# Altium schematic sheet Relay.SchDoc
size A4
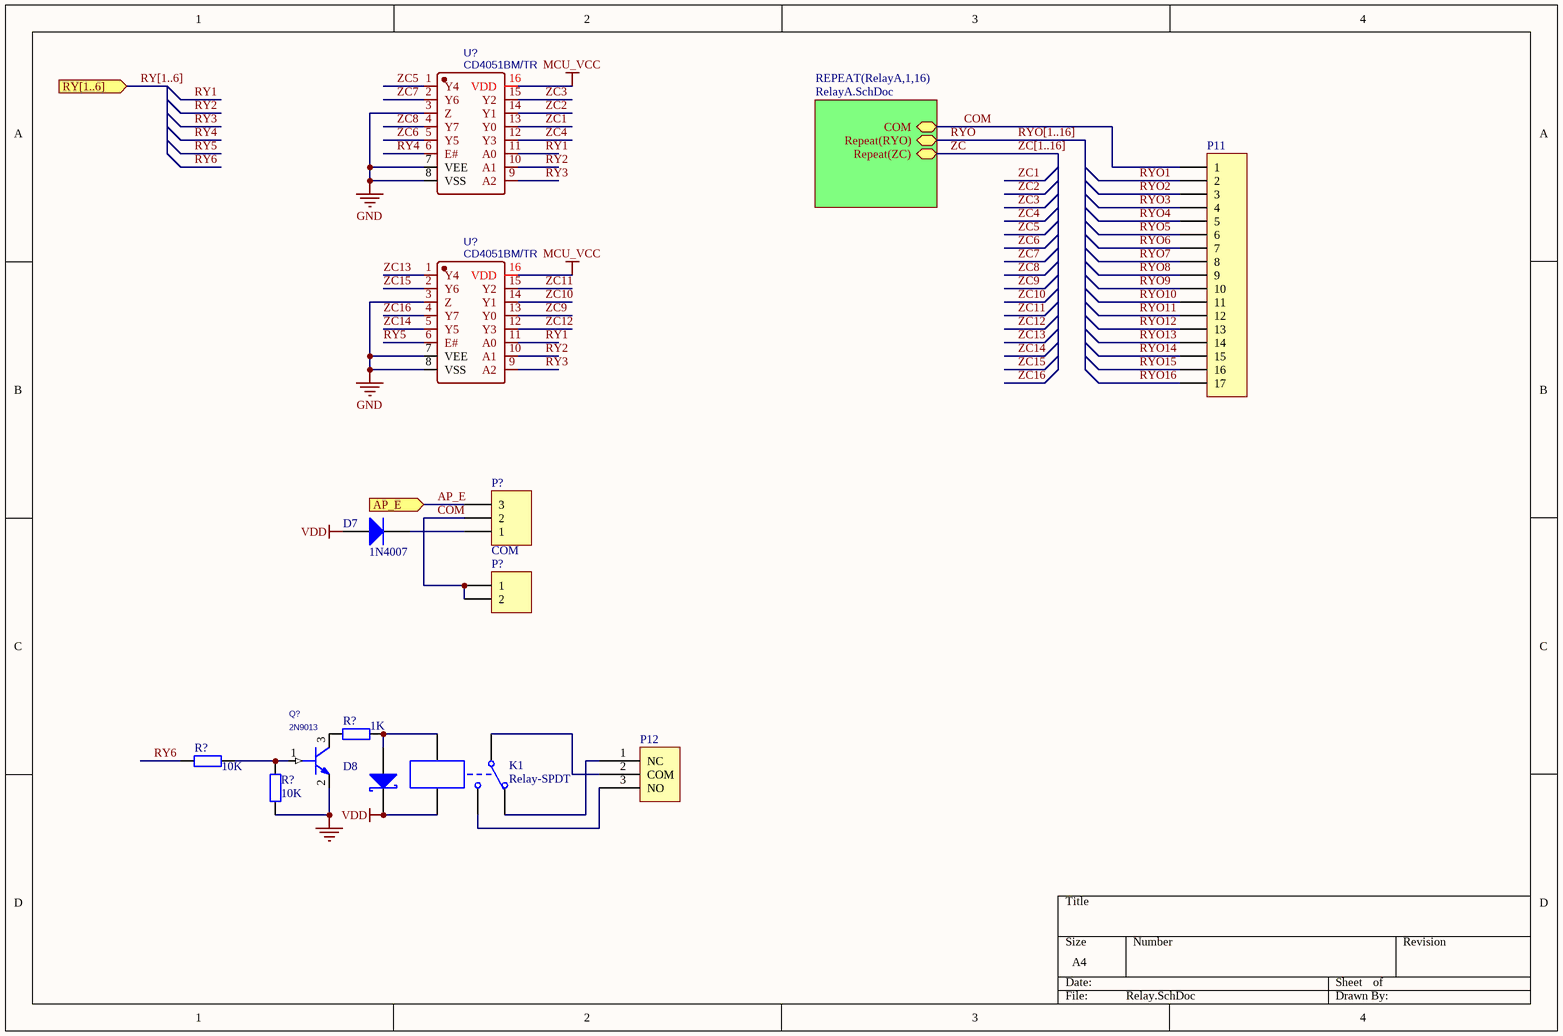
[diagram p0: Relay.SchDoc]

## Parts
(Parts that share a designator on the sheet are numbered #1, #2 ... from top to bottom, then left to right.)
D7  1N4007  [SO-0.4A]
D8  (no value)  [SO-0.4A]
K1  Relay-SPDT  [RELAY-TH_ZC-32F-012-ZS3-555]
P11  (no value)  [HDR1X17]
P12  (no value)  [HDR1X3]
P?#1  COM  [HDR1X3]
P?#2  Header 2  [SIP2]  (value not drawn)
Q?  2N9013  [SOT-23]
R?#1  value 1K  [R0603]
R?#2  value 10K  [R0603]
R?#3  value 10K  [R0603]
U?#1  CD4051BM/TR  [SOP-16_L9.9-W3.9-P1.27-LS6.1-BL]
U?#2  CD4051BM/TR  [SOP-16_L9.9-W3.9-P1.27-LS6.1-BL]

## Sub-sheets
REPEAT(RelayA,1,16) = RelayA.SchDoc: COM, Repeat(ZC) (bidir), Repeat(RYO) (bidir)

## Ports
AP_E (in), RY[1..6] (in)

## Nets
GND: Q?.2(E) R?#3.1 U?#1.3(Z) U?#1.7(VEE) U?#1.8(VSS) U?#2.3(Z) U?#2.7(VEE) U?#2.8(VSS)
MCU_VCC: U?#1.16(VDD) U?#2.16(VDD)
VDD: D7.A D8.K K1.5
AP_E: P?#1.3 ; port AP_E
COM: P11.1 P?#1.2 P?#2.1 P?#2.2 ; sheet REPEAT(RelayA,1,16)/COM
RY1: U?#1.11(A0) U?#2.11(A0)
RY2: U?#1.10(A1) U?#2.10(A1)
RY3: U?#1.9(A2) U?#2.9(A2)
RY4: U?#1.6(E#)
RY5: U?#2.6(E#)
RY6: R?#2.1
RYO: sheet REPEAT(RelayA,1,16)/Repeat(RYO)
RYO1: P11.2
RYO2: P11.3
RYO3: P11.4
RYO4: P11.5
RYO5: P11.6
RYO6: P11.7
RYO7: P11.8
RYO8: P11.9
RYO9: P11.10
RYO10: P11.11
RYO11: P11.12
RYO12: P11.13
RYO13: P11.14
RYO14: P11.15
RYO15: P11.16
RYO16: P11.17
ZC: sheet REPEAT(RelayA,1,16)/Repeat(ZC)
ZC1: U?#1.13(Y0)
ZC2: U?#1.14(Y1)
ZC3: U?#1.15(Y2)
ZC4: U?#1.12(Y3)
ZC5: U?#1.1(Y4)
ZC6: U?#1.5(Y5)
ZC7: U?#1.2(Y6)
ZC8: U?#1.4(Y7)
ZC9: U?#2.13(Y0)
ZC10: U?#2.14(Y1)
ZC11: U?#2.15(Y2)
ZC12: U?#2.12(Y3)
ZC13: U?#2.1(Y4)
ZC14: U?#2.5(Y5)
ZC15: U?#2.2(Y6)
ZC16: U?#2.4(Y7)
NetD7_K: D7.K P?#1.1
NetD8_A: D8.A K1.4 R?#1.2
NetK1_1: K1.1 P12.2(COM)
NetK1_2: K1.2 P12.1(NC)
NetK1_3: K1.3 P12.3(NO)
NetQ?_1: Q?.1(B) R?#2.2 R?#3.2
NetQ?_3: Q?.3(C) R?#1.1

## Buses and harness runs
bus RY[1..6] = port RY[1..6]
bus RYO[1..16]
bus ZC[1..16]

## Library data of the parts
D7 = Diode 1N4001: 1 Amp General Purpose Rectifier; Published: 8-Jun-2000; LatestRevisionDate: 17-Jul-2002; LatestRevisionNote: Re-released for DXP Platform.; DatasheetVersion: 1998; PackageVersion: Aug-1999; PackageReference: DO-41; Publisher: Altium Limited; PackageDescription: Diode, Axial; Body 5.2 x 2.7 mm (LxDia. max), Lead Dia. 0.86 mm (max); Code_JEDEC: DO-204-AL; ComponentLink1Description: Manufacturer Link; ComponentLink1URL: http://www.fairchildsemi.com/; ComponentLink2Description: Datasheet; ComponentLink2URL: http://www.fairchildsemi.com/ds/1N%2F1N4001.pdf
D8 = D Schottky: Schottky Diode; Published: 8-Jun-2000; LatestRevisionDate: 17-Jul-2002; LatestRevisionNote: Re-released for DXP Platform.; PackageReference: SMB; Publisher: Altium Limited; PackageDescription: DO-214-AA/SMB; 2 C-Bend Leads; Body 5.3 x 3.6 mm, inc. leads (LxW); Code_JEDEC: DO-214-AA
K1 = Relay-SPDT: Single-Pole Dual-Throw Relay; Published: 24-Mar-1999; LatestRevisionDate: 17-Jul-2002; LatestRevisionNote: Re-released for DXP Platform.; PackageReference: MODULE5B; Publisher: Altium Limited
P11 = Header 17: Header, 17-Pin; LatestRevisionDate: 17-Jul-2002; LatestRevisionNote: Re-released for DXP Platform.; Publisher: Altium Limited
P12 = Component_1
P?#1 = Header 3: Header, 3-Pin; LatestRevisionDate: 17-Jul-2002; LatestRevisionNote: Re-released for DXP Platform.; Publisher: Altium Limited
P?#2 = Header 2: Header, 2-Pin; LatestRevisionDate: 17-Jul-2002; LatestRevisionNote: Re-released for DXP Platform.; Publisher: Altium Limited
Q? = NPN_0
R?#1-R?#3 = Res2: Resistor; Published: 8-Jun-2000; LatestRevisionDate: 17-Jul-2002; LatestRevisionNote: Re-released for DXP Platform.; PackageReference: AXIAL-0.4; Publisher: Altium Limited; PackageDescription: Axial Device, Thru-Hole; 2 Leads; 0.4 in Pin Spacing
U?#1 U?#2 = CD4051BM/TR: BOM_Manufacturer: HGSEMI; Contributor: LCSC; BOM_Supplier: LCSC; BOM_Supplier Part: C507163; BOM_Manufacturer Part: CD4051BM/TR; BOM_JLCPCB Part Class: Extended Part; spicePre: U; spiceSymbolName: CD4051BM/TR